# EAGLE design S602H (EAGLE 4.11)
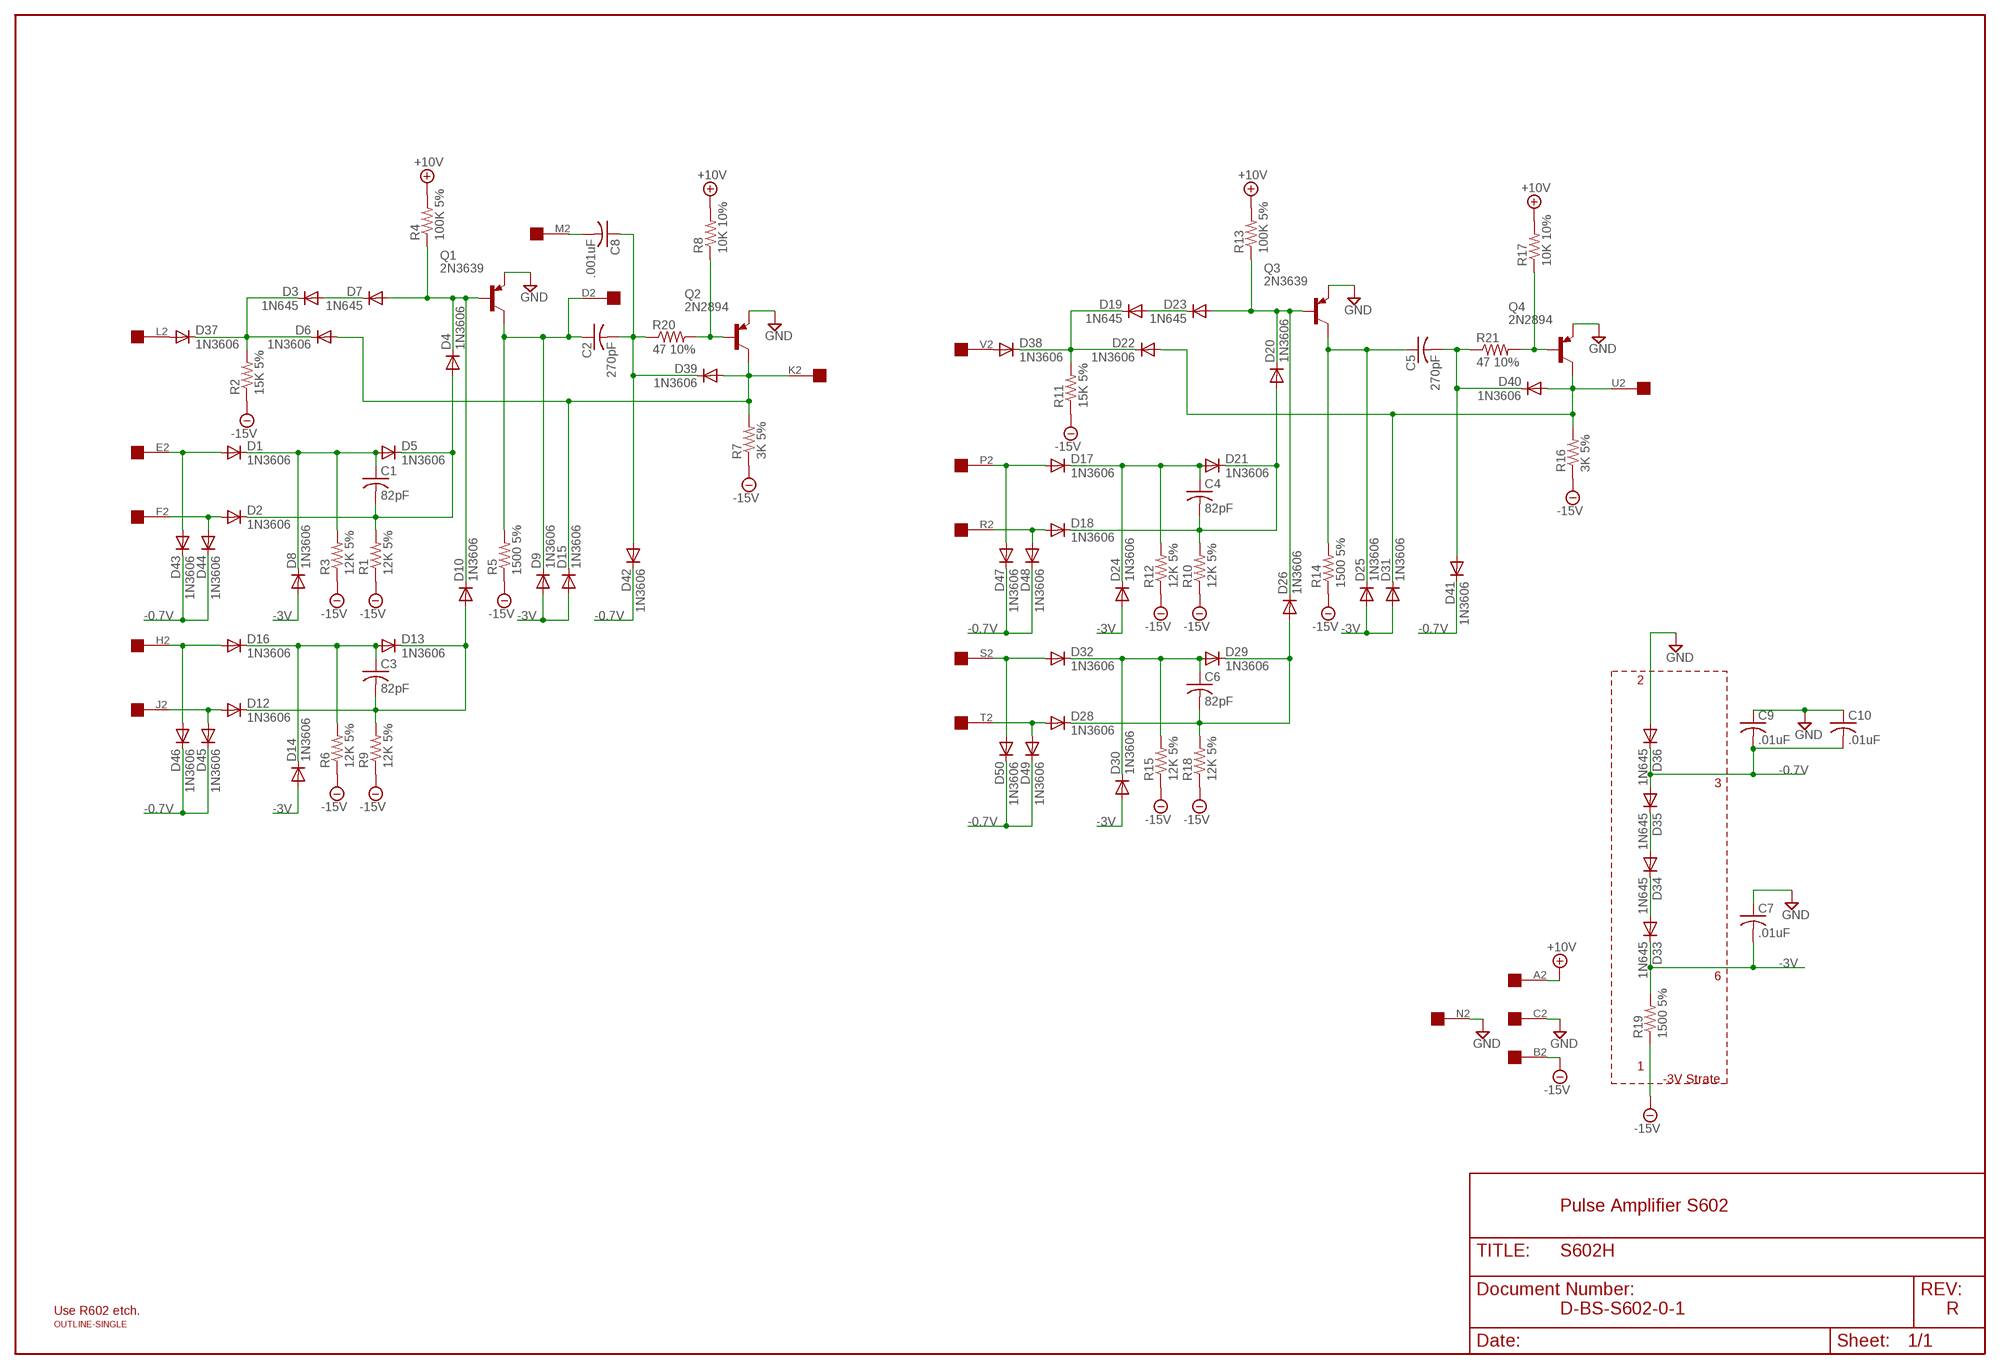
[diagram p0: schematic, sheet 1]

## Parts
C1  82pF  C-US050-025X075  [C050-025X075]
C2  270pF  C-US050-025X075  [C050-025X075]
C3  82pF  C-US050-025X075  [C050-025X075]
C4  82pF  C-US050-025X075  [C050-025X075]
C5  270pF  C-US050-025X075  [C050-025X075]
C6  82pF  C-US050-025X075  [C050-025X075]
C7  .01uF  C-US075-032X103  [C075-032X103]
C8  .001uF  C-US050-025X075  [C050-025X075]
C9  .01uF  C-US050-025X075  [C050-025X075]
C10  .01uF  C-US050-025X075  [C050-025X075]
D1  1N3606  1N4148  [DO35-10]
D2  1N3606  1N4148  [DO35-10]
D3  1N645  1N4148  [DO35-10]
D4  1N3606  1N4148  [DO35-10]
D5  1N3606  1N4148  [DO35-10]
D6  1N3606  1N4148  [DO35-10]
D7  1N645  1N4148  [DO35-10]
D8  1N3606  1N4148  [DO35-10]
D9  1N3606  1N4148  [DO35-10]
D10  1N3606  1N4148  [DO35-10]
D12  1N3606  1N4148  [DO35-10]
D13  1N3606  1N4148  [DO35-10]
D14  1N3606  1N4148  [DO35-10]
D15  1N3606  1N4148  [DO35-10]
D16  1N3606  1N4148  [DO35-10]
D17  1N3606  1N4148  [DO35-10]
D18  1N3606  1N4148  [DO35-10]
D19  1N645  1N4148  [DO35-10]
D20  1N3606  1N4148  [DO35-10]
D21  1N3606  1N4148  [DO35-10]
D22  1N3606  1N4148  [DO35-10]
D23  1N645  1N4148  [DO35-10]
D24  1N3606  1N4148  [DO35-10]
D25  1N3606  1N4148  [DO35-10]
D26  1N3606  1N4148  [DO35-10]
D28  1N3606  1N4148  [DO35-10]
D29  1N3606  1N4148  [DO35-10]
D30  1N3606  1N4148  [DO35-10]
D31  1N3606  1N4148  [DO35-10]
D32  1N3606  1N4148  [DO35-10]
D33  1N645  1N4148  [DO35-10]
D34  1N645  1N4148  [DO35-10]
D35  1N645  1N4148  [DO35-10]
D36  1N645  1N4148  [DO35-10]
D37  1N3606  1N4148  [DO35-10]
D38  1N3606  1N4148  [DO35-10]
D39  1N3606  1N4148  [DO35-10]
D40  1N3606  1N4148  [DO35-10]
D41  1N3606  1N4148  [DO35-10]
D42  1N3606  1N4148  [DO35-10]
D43  1N3606  1N4148  [DO35-10]
D44  1N3606  1N4148  [DO35-10]
D45  1N3606  1N4148  [DO35-10]
D46  1N3606  1N4148  [DO35-10]
D47  1N3606  1N4148  [DO35-10]
D48  1N3606  1N4148  [DO35-10]
D49  1N3606  1N4148  [DO35-10]
D50  1N3606  1N4148  [DO35-10]
Q1  2N3639  2N2904  [TO39]
Q2  2N2894  2N2904  [TO39]
Q3  2N3639  2N2904  [TO39]
Q4  2N2894  2N2904  [TO39]
R1  12K 5%  R-US_0207/10  [0207/10]
R2  15K 5%  R-US_0207/10  [0207/10]
R3  12K 5%  R-US_0207/10  [0207/10]
R4  100K 5%  R-US_0207/10  [0207/10]
R5  1500 5%  R-US_0207/10  [0207/10]
R6  12K 5%  R-US_0207/10  [0207/10]
R7  3K 5%  R-US_0207/10  [0207/10]
R8  10K 10%  R-US_0207/10  [0207/10]
R9  12K 5%  R-US_0207/10  [0207/10]
R10  12K 5%  R-US_0207/10  [0207/10]
R11  15K 5%  R-US_0207/10  [0207/10]
R12  12K 5%  R-US_0207/10  [0207/10]
R13  100K 5%  R-US_0207/10  [0207/10]
R14  1500 5%  R-US_0207/10  [0207/10]
R15  12K 5%  R-US_0207/10  [0207/10]
R16  3K 5%  R-US_0207/10  [0207/10]
R17  10K 10%  R-US_0207/10  [0207/10]
R18  12K 5%  R-US_0207/10  [0207/10]
R19  1500 5%  R-US_0207/10  [0207/10]
R20  47 10%  R-US_0207/10  [0207/10]
R21  47 10%  R-US_0207/10  [0207/10]
U$1  OUTLINE-SINGLE  [SINGLE]
U$2  EDGE-1  [EDGE-CON1]

## Nets
+10V [Supply]: R4.2 R8.2 R13.2 R17.2 U$2.A2
-0.7V [Supply]: C9.2 C10.2 D35.A D36.C D41.C D42.C D43.C D44.C D45.C D46.C D47.C D48.C D49.C D50.C
-3V [Supply]: C7.2 D8.A D9.A D14.A D15.A D24.A D25.A D30.A D31.A D33.C R19.2
-15V [Supply]: R1.1 R2.1 R3.1 R5.1 R6.1 R7.1 R9.1 R10.1 R11.1 R12.1 R14.1 R15.1 R16.1 R18.1 R19.1 U$2.B2
GND [Supply]: C7.1 C9.1 C10.1 D36.A Q1.1(E) Q2.1(E) Q3.1(E) Q4.1(E) U$2.C2 U$2.N2
N$1: D37.A U$2.L2
N$2: D3.C D6.C D37.C R2.2
N$3: D1.A D43.A U$2.E2
N$4: D2.A D44.A U$2.F2
N$5: C1.1 D1.C D5.A D8.C R3.2
N$6: C1.2 D2.C D4.A D5.C R1.2
N$7: D3.A D7.C
N$8 [Supply]: D34.A D35.C
N$9 [Supply]: D33.A D34.C
N$10: D4.C D7.A D10.C Q1.2(B) R4.1
N$11: C2.1 D9.C Q1.3(C) R5.2 U$2.D2
N$12: C2.2 C8.1 D39.C D42.A R20.1
N$13: Q2.2(B) R8.1 R20.2
N$14: D6.A D15.C D39.A Q2.3(C) R7.2 U$2.K2
N$15: D16.A D46.A U$2.H2
N$16: D12.A D45.A U$2.J2
N$17: C3.1 D13.A D14.C D16.C R6.2
N$18: C3.2 D10.A D12.C D13.C R9.2
N$19: D17.A D47.A U$2.P2
N$20: D18.A D48.A U$2.R2
N$21: C4.1 D17.C D21.A D24.C R12.2
N$22: C4.2 D18.C D20.A D21.C R10.2
N$23: D38.A U$2.V2
N$24: D19.C D22.C D38.C R11.2
N$25: D19.A D23.C
N$26: D20.C D23.A D26.C Q3.2(B) R13.1
N$27: C5.1 D25.C Q3.3(C) R14.2
N$28: C5.2 D40.C D41.A R21.1
N$29: Q4.2(B) R17.1 R21.2
N$30: D22.A D31.C D40.A Q4.3(C) R16.2 U$2.U2
N$31: D32.A D50.A U$2.S2
N$32: D28.A D49.A U$2.T2
N$33: C6.1 D29.A D30.C D32.C R15.2
N$34: C6.2 D26.A D28.C D29.C R18.2
N$35: C8.2 U$2.M2

## Notes on the sheet
- 2
- 3
- 6
- 1
- -3V Strate
- Pulse Amplifier S602
- Use R602 etch. | D-BS-S602-0-1 | R

## Library data of the parts
C1-C10 = rcl:C-US: CAPACITOR, American symbol
D1-D10 D12-D26 D28-D50 = diode:1N4148: DIODE high speed (Philips)
Q1-Q4 = transistor-pnp:2N2904*: PNP Transistror
R1-R21 = rcl:R-US_: RESISTOR, American symbol
U$1 = dec-con:OUTLINE-*: Board outlines for DEC boards.
U$2 = dec-con:EDGE-1: Single-Sided DEC Edge Connector -- (side 2)

## Net classes
1 Supply: width 0.813 mm

## Board
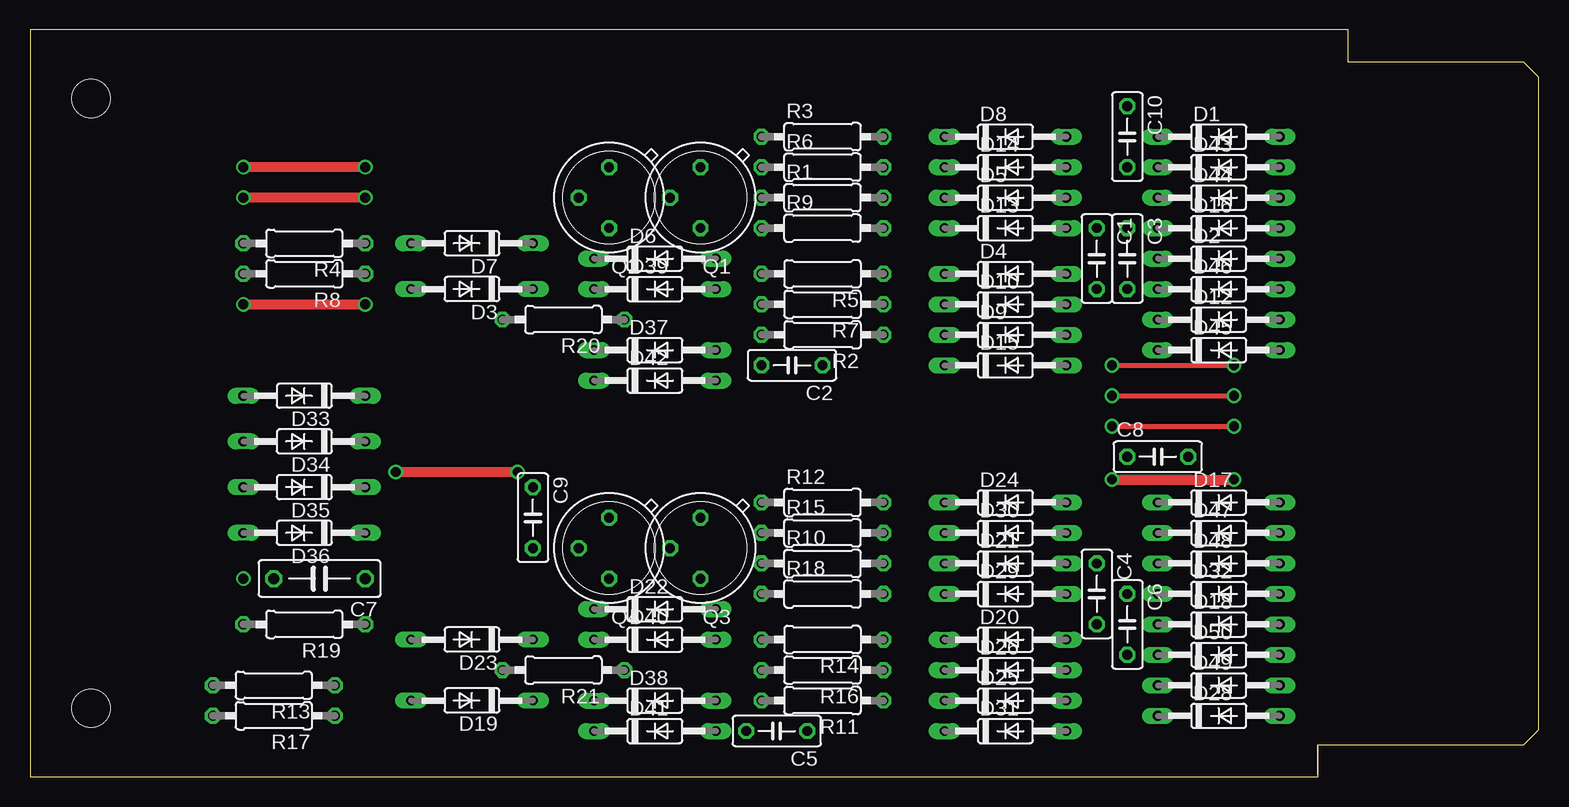
[diagram p1: board, top side]
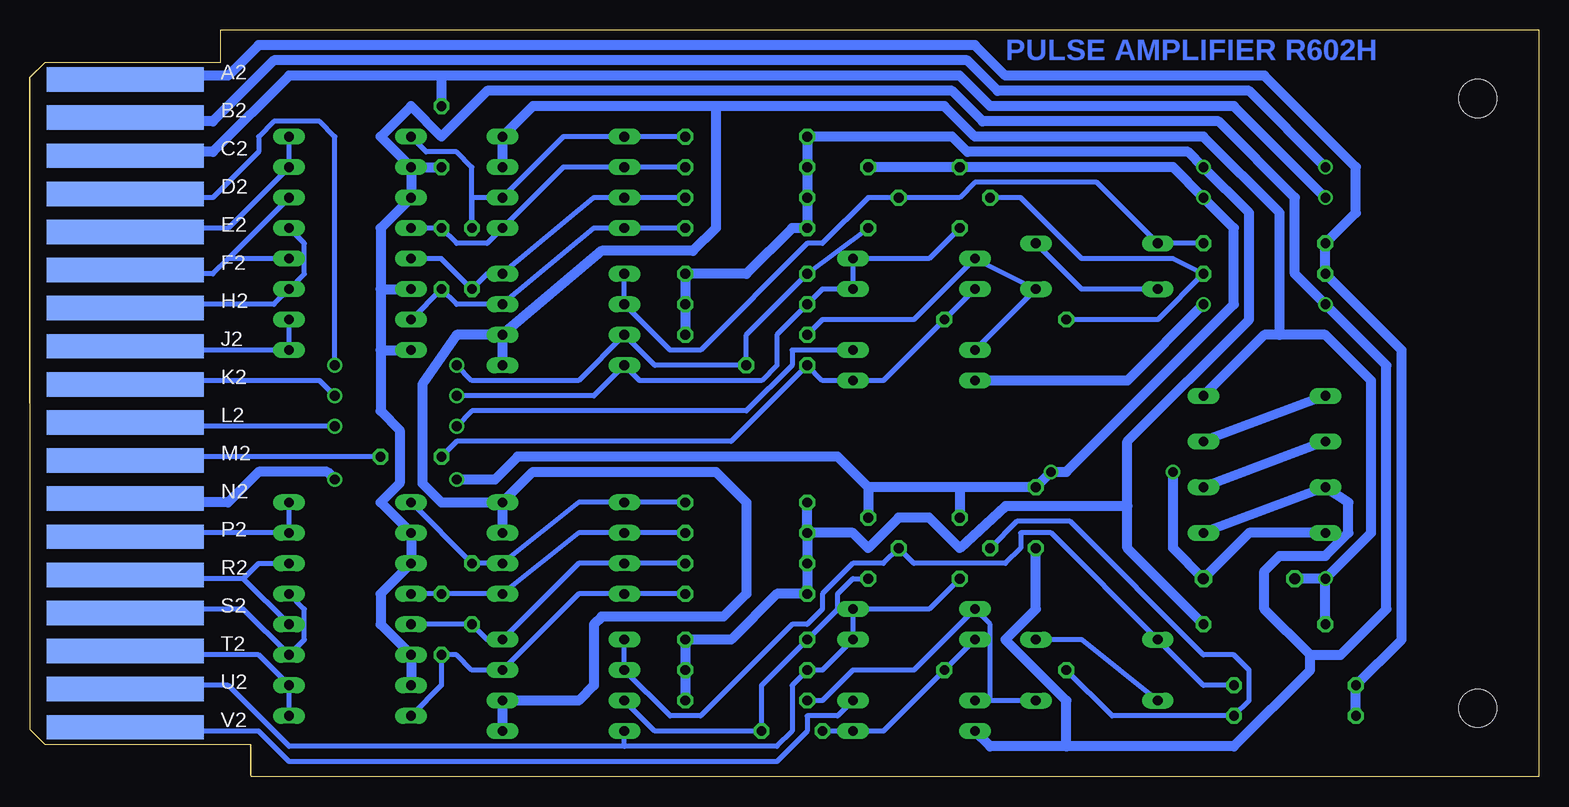
[diagram p2: board, bottom side, seen from below]

Size 125.73 x 62.23 mm. Coordinates in mm from the lower left corner, seen from the top.
Copper layers (1+16): Top 0.035mm / dielectric 1.5mm / Bottom 0.035mm
Design rules "16mils": minimum track width 16mil, minimum drill 32mil, track to track 15mil, track to pad 10mil, pad to pad 10mil, via to via 10mil, smd to smd 10mil, copper to edge 13mil, drill to drill 10mil, minimum pad ring 10mil, minimum via ring 8mil, stop-mask expansion 0mil, vias tented up to drill 0mil, thermal gap 10mil

### Footprints (pad centres in the part's own frame; a part is rotated, then mirrored left to right if it is on the bottom)
C050-025X075 = drill 0.813 octagon: 1 -2.54,0; 2 2.54,0
C075-032X103 = drill 0.914 octagon: 1 -3.81,0; 2 3.81,0
DO35-10 = drill 0.813 long: A 5.08,0; C -5.08,0
TO39 = drill 0.813 octagon: 1 0,-2.54; 2 2.54,0; 3 0,2.54
0207/10 = drill 0.813 octagon: 1 -5.08,0; 2 5.08,0
SINGLE = hole 3.175: 120.65,56.515; 120.65,5.715
EDGE-CON1 = smd 13.106 x 2.032 bottom: A2 7.938,4.128; B2 7.938,7.303; C2 7.938,10.477; D2 7.938,13.652; E2 7.938,16.828; F2 7.938,20.003; H2 7.938,23.177; J2 7.938,26.352; K2 7.938,29.527; L2 7.938,32.703; M2 7.938,35.877; N2 7.938,39.053; P2 7.938,42.227; R2 7.938,45.403; S2 7.938,48.578; T2 7.938,51.752; U2 7.938,54.928; V2 7.938,58.102

### Placement (x,y rotation side)
C1  88.9,43.18 270 top
C2  63.5,34.29 180 top
C3  91.44,43.18 270 top
C4  88.9,15.24 270 top
C5  62.23,3.81 180 top
C6  91.44,12.7 270 top
C7  24.13,16.51 180 top
C8  93.98,26.67 0 top
C9  41.91,21.59 270 top
C10  91.44,53.34 270 top
D1  99.06,53.34 0 top
D2  99.06,43.18 0 top
D3  36.83,40.64 180 top
D4  81.28,41.91 0 top
D5  81.28,48.26 0 top
D6  52.07,43.18 0 top
D7  36.83,44.45 180 top
D8  81.28,53.34 0 top
D9  81.28,36.83 0 top
D10  81.28,39.37 0 top
D12  99.06,38.1 0 top
D13  81.28,45.72 0 top
D14  81.28,50.8 0 top
D15  81.28,34.29 0 top
D16  99.06,45.72 0 top
D17  99.06,22.86 0 top
D18  99.06,12.7 0 top
D19  36.83,6.35 180 top
D20  81.28,11.43 0 top
D21  81.28,17.78 0 top
D22  52.07,13.97 0 top
D23  36.83,11.43 180 top
D24  81.28,22.86 0 top
D25  81.28,6.35 0 top
D26  81.28,8.89 0 top
D28  99.06,5.08 0 top
D29  81.28,15.24 0 top
D30  81.28,20.32 0 top
D31  81.28,3.81 0 top
D32  99.06,15.24 0 top
D33  22.86,31.75 180 top
D34  22.86,27.94 180 top
D35  22.86,24.13 180 top
D36  22.86,20.32 180 top
D37  52.07,35.56 0 top
D38  52.07,6.35 0 top
D39  52.07,40.64 0 top
D40  52.07,11.43 0 top
D41  52.07,3.81 0 top
D42  52.07,33.02 0 top
D43  99.06,50.8 0 top
D44  99.06,48.26 0 top
D45  99.06,35.56 0 top
D46  99.06,40.64 0 top
D47  99.06,20.32 0 top
D48  99.06,17.78 0 top
D49  99.06,7.62 0 top
D50  99.06,10.16 0 top
Q1  55.88,48.26 180 top
Q2  48.26,48.26 180 top
Q3  55.88,19.05 180 top
Q4  48.26,19.05 180 top
R1  66.04,48.26 0 top
R2  66.04,36.83 180 top
R3  66.04,53.34 0 top
R4  22.86,44.45 180 top
R5  66.04,41.91 180 top
R6  66.04,50.8 0 top
R7  66.04,39.37 180 top
R8  22.86,41.91 180 top
R9  66.04,45.72 0 top
R10  66.04,17.78 0 top
R11  66.04,6.35 180 top
R12  66.04,22.86 0 top
R13  20.32,7.62 180 top
R14  66.04,11.43 180 top
R15  66.04,20.32 0 top
R16  66.04,8.89 180 top
R17  20.32,5.08 180 top
R18  66.04,15.24 0 top
R19  22.86,12.7 180 top
R20  44.45,38.1 180 top
R21  44.45,8.89 180 top
U$1  125.73,62.23 180 top
U$2  125.73,62.23 180 top

### Tracks (layer width: path | path; a pad name or v marks a point on that pad's centre or on a via)
+10V
  Bottom 0.813: U$2.A2 117.22,58.04 116.84,58.42 109.22,58.42 106.68,60.96 46.99,60.96 44.45,58.42 22.86,58.42 15.24,50.8 15.24,46.99 R4.2 R8.2 11.43,35.56 11.43,11.43 R13.2 R17.2
-0.7V  (via drill 0.81)
  Top 0.813: v17.78,39.37 v27.94,39.37
  Bottom 0.813: 96.52,35.56 D45.C | 96.52,40.64 96.52,35.56 | 96.52,40.64 D46.C | 96.52,40.64 96.52,45.72 D44.C D43.C | D49.C D50.C 96.52,12.7 96.52,15.24 D48.C D47.C 96.52,22.86 94.93,24.45 94.93,28.89 96.52,30.48 96.52,35.56 | D43.C 96.52,53.34 93.98,55.88 91.44,53.34 87.63,57.15 48.9,57.15 46.35,54.61 26.67,54.61 20.32,48.26 20.32,41.91 v17.78,39.37 12.7,34.29 12.7,13.97 16.51,10.16 19.05,10.16 | D43.C C10.2 | D42.C 34.29,33.02 v27.94,39.37 | D36.C D35.A 15.88,22.86 15.88,20.32 17.78,18.41 21.59,18.41 22.86,17.14 22.86,13.97 19.05,10.16 | 39.37,2.54 45.72,2.54 D41.C | 39.37,2.54 39.37,6.35 44.45,11.43 41.91,13.97 C9.2 | 39.37,2.54 25.4,2.54 19.05,8.89 19.05,10.16
-3V  (via drill 0.81)
  Bottom 0.813: D14.A D8.A 83.82,55.88 68.58,55.88 | 68.58,55.88 68.58,45.72 70.48,43.81 78.11,43.81 D9.A | 68.58,55.88 49.53,55.88 46.99,53.34 27.94,53.34 21.59,46.99 21.59,36.83 | D9.A D15.A | 21.59,36.83 22.86,36.83 D33.C | 21.59,36.83 17.78,36.83 13.97,33.02 13.97,20.32 v17.78,16.51 | R19.2 v17.78,16.51 | v17.78,16.51 C7.2 | D24.A D30.A | D24.A 83.82,25.4 68.58,25.4 66.04,22.86 66.04,15.24 67.94,13.34 78.11,13.34 78.74,12.7 78.74,7.62 80.01,6.35 D25.A D31.A | D9.A 90.17,36.83 93.03,32.7 93.03,24.45 91.44,22.86 D24.A
-15V  (via drill 0.81)
  Top 0.813: v27.94,50.8 v17.78,50.8
  Bottom 0.813: U$2.B2 117.13,54.9 116.84,54.61 110.49,54.61 105.41,59.69 47.62,59.69 45.09,57.15 24.13,57.15 v17.78,50.8 | R2.1 R7.1 R5.1 66.04,41.91 62.23,45.72 R9.1 R1.1 R6.1 R3.1 48.9,53.34 47.62,52.07 29.21,52.07 v27.94,50.8 24.13,46.99 24.13,38.1 34.29,27.94 34.29,22.54 | R15.1 R12.1 | R15.1 R10.1 R18.1 63.5,15.24 67.31,11.43 R14.1 R16.1 R11.1 | R15.1 57.15,20.32 55.88,19.05 53.34,21.59 50.8,21.59 48.26,19.05 44.45,22.54 34.29,22.54 | R19.1 34.29,19.05 34.29,22.54
GND  (via drill 0.81)
  Top 0.813: v90.17,24.77 v100.33,24.77 | v27.94,48.26 v17.78,48.26 | v30.48,25.4 v40.64,25.4
  Bottom 0.813: U$2.C2 117.17,51.74 116.84,52.07 110.49,52.07 104.14,58.42 91.44,58.42 | 91.44,58.42 C10.1 | U$2.N2 117.17,23.19 116.84,22.86 109.22,22.86 106.68,25.4 100.97,25.4 v100.33,24.77 | Q1.1 Q2.1 30.48,50.8 v27.94,48.26 25.4,45.72 25.4,39.37 39.37,25.4 v40.64,25.4 C9.1 48.26,24.13 | v17.78,48.26 25.4,55.88 45.72,55.88 48.26,58.42 91.44,58.42 | D36.A 24.13,20.32 C7.1 30.48,19.05 v30.48,25.4 | 48.26,24.13 55.88,24.13 | 55.88,24.13 Q3.1 | 48.26,24.13 Q4.1 | v90.17,24.77 87,24.77 85.09,26.67 58.42,26.67 55.88,24.13
N$1  (via drill 0.81)
  Top 0.406: v90.17,29.21 v100.33,29.21
  Bottom 0.406: U$2.L2 117.17,29.54 116.84,29.21 v100.33,29.21 | D37.A 62.23,35.56 62.23,34.29 66.04,30.48 88.9,30.48 v90.17,29.21
N$2
  Bottom 0.406: D37.C D3.C D6.C 52.07,38.1 59.69,38.1 R2.2
N$3
  Bottom 0.406: U$2.E2 117.17,45.39 116.84,45.72 109.22,45.72 D43.A D1.A
N$4
  Bottom 0.406: U$2.F2 117.12,42.19 116.84,41.91 110.49,41.91 109.22,43.18 | D2.A 109.22,43.18 | 109.22,43.18 D44.A
N$5
  Bottom 0.406: D1.C 92.71,52.07 90.17,52.07 88.9,50.8 C1.1 88.9,48.26 D5.A 81.28,53.34 D8.C R3.2
N$6
  Bottom 0.406: D2.C 91.44,43.18 C1.2 87.63,41.91 D4.A 78.74,48.26 D5.C R1.2
N$7
  Bottom 0.406: D3.A 38.1,40.64 D7.C
N$8
  Bottom 0.813: D34.A D35.C
N$9
  Bottom 0.813: D33.A D34.C
N$10
  Bottom 0.406: D4.C D10.C 72.39,35.56 69.85,35.56 60.96,44.45 59.69,44.45 55.88,48.26 Q1.2 48.26,48.26 46.99,49.53 36.83,49.53 D7.A R4.1
N$11  (via drill 0.81)
  Top 0.406: v90.17,34.29 v100.33,34.29
  Bottom 0.406: U$2.D2 117.14,48.56 116.84,48.26 110.49,48.26 106.68,52.07 106.68,53.34 105.41,54.61 101.6,54.61 100.33,53.34 v100.33,34.29 | v90.17,34.29 88.9,33.02 80.01,33.02 D9.C 73.66,34.29 C2.1 66.04,36.83 R5.2 Q1.3
N$12
  Bottom 0.406: C8.1 90.17,27.94 67.31,27.94 C2.2 59.69,33.02 D42.A 54.61,33.02 R20.1 D39.C
N$13
  Bottom 0.406: Q2.2 43.18,48.26 38.1,43.18 30.48,43.18 R8.1 31.75,38.1 R20.2
N$14  (via drill 0.81)
  Top 0.406: v90.17,31.75 v100.33,31.75
  Bottom 0.406: U$2.K2 117.14,32.72 116.84,33.02 101.6,33.02 v100.33,31.75 | v90.17,31.75 78.74,31.75 D15.C 74.93,33.02 64.77,33.02 63.5,34.29 63.5,36.83 R7.2 59.69,40.64 D39.A D6.A 50.8,43.18 Q2.3
N$15
  Bottom 0.406: U$2.H2 118.09,39.35 118.11,39.37 105.41,39.37 D46.A 102.87,41.91 102.87,44.45 D16.A
N$16
  Bottom 0.406: U$2.J2 117.17,35.89 116.84,35.56 D45.A D12.A
N$17
  Bottom 0.406: D16.C C3.1 90.17,44.45 87.63,44.45 D13.A 81.28,50.8 D14.C R6.2
N$18
  Bottom 0.406: D12.C C3.2 90.17,39.37 D10.A 78.74,45.72 D13.C R9.2
N$19
  Bottom 0.406: U$2.P2 118.06,20.27 118.11,20.32 D47.A D17.A
N$20
  Bottom 0.406: U$2.R2 118.06,16.56 118.11,16.51 107.95,16.51 | D18.A 107.95,16.51 | D48.A 106.68,17.78 107.95,16.51
N$21
  Bottom 0.406: D17.C C4.1 D21.A 80.01,22.86 D24.C R12.2
N$22
  Bottom 0.406: D18.C C4.2 87.63,11.43 D20.A 80.01,17.78 D21.C R10.2
N$23
  Bottom 0.406: U$2.V2 118.11,4.13 118.11,3.81 106.68,3.81 104.14,1.27 63.5,1.27 60.96,3.81 60.96,5.08 58.42,5.08 D38.A
N$24
  Bottom 0.406: R11.2 59.69,6.35 57.15,8.89 52.07,8.89 D22.C 45.72,12.7 45.72,6.35 | 45.72,6.35 D38.C | D19.C 45.72,6.35
N$25
  Bottom 0.406: D23.C 38.1,11.43 D19.A
N$26
  Bottom 0.406: D20.C D26.C 72.39,5.08 69.85,5.08 62.23,12.7 60.96,12.7 59.69,13.97 59.69,15.24 57.15,17.78 54.61,17.78 Q3.2 52.07,17.78 44.45,17.78 43.18,19.05 43.18,20.32 40.64,20.32 D23.A 27.94,7.62 R13.1
N$27
  Bottom 0.406: D25.C 73.66,3.81 C5.1 64.77,7.62 R14.2 58.42,13.97 58.42,15.24 57.15,16.51 Q3.3
N$28
  Bottom 0.406: D40.C R21.1 54.61,3.81 D41.A C5.2
N$29
  Bottom 0.406: R21.2 35.56,5.08 R17.1 24.13,6.35 24.13,8.89 25.4,10.16 27.94,10.16 39.05,21.27 43.5,21.27 Q4.2
N$30
  Bottom 0.406: U$2.U2 118.04,7.55 118.11,7.62 109.22,7.62 104.14,2.54 76.2,2.54 | 76.2,2.54 D31.C | 76.2,2.54 63.5,2.54 62.23,3.81 62.23,7.62 R16.2 59.69,8.89 D40.A D22.A 50.8,13.97 Q4.3
N$31
  Bottom 0.406: U$2.S2 118.04,13.9 118.11,13.97 107.95,13.97 D50.A 102.87,11.43 102.87,13.97 D32.A
N$32
  Bottom 0.406: U$2.T2 118.04,10.23 118.11,10.16 106.68,10.16 D49.A D28.A
N$33
  Bottom 0.406: D32.C C6.1 D29.A 80.01,20.32 D30.C R15.2
N$34
  Bottom 0.406: D28.C 91.44,7.62 C6.2 90.17,10.16 88.9,8.89 D26.A 80.01,15.24 D29.C R18.2
N$35
  Bottom 0.406: U$2.M2 117.17,26.34 116.84,26.67 C8.2

### Text on the board
Bottom: PULSE AMPLIFIER R602H